# Altium schematic sheet TOP.SchDoc
size A3
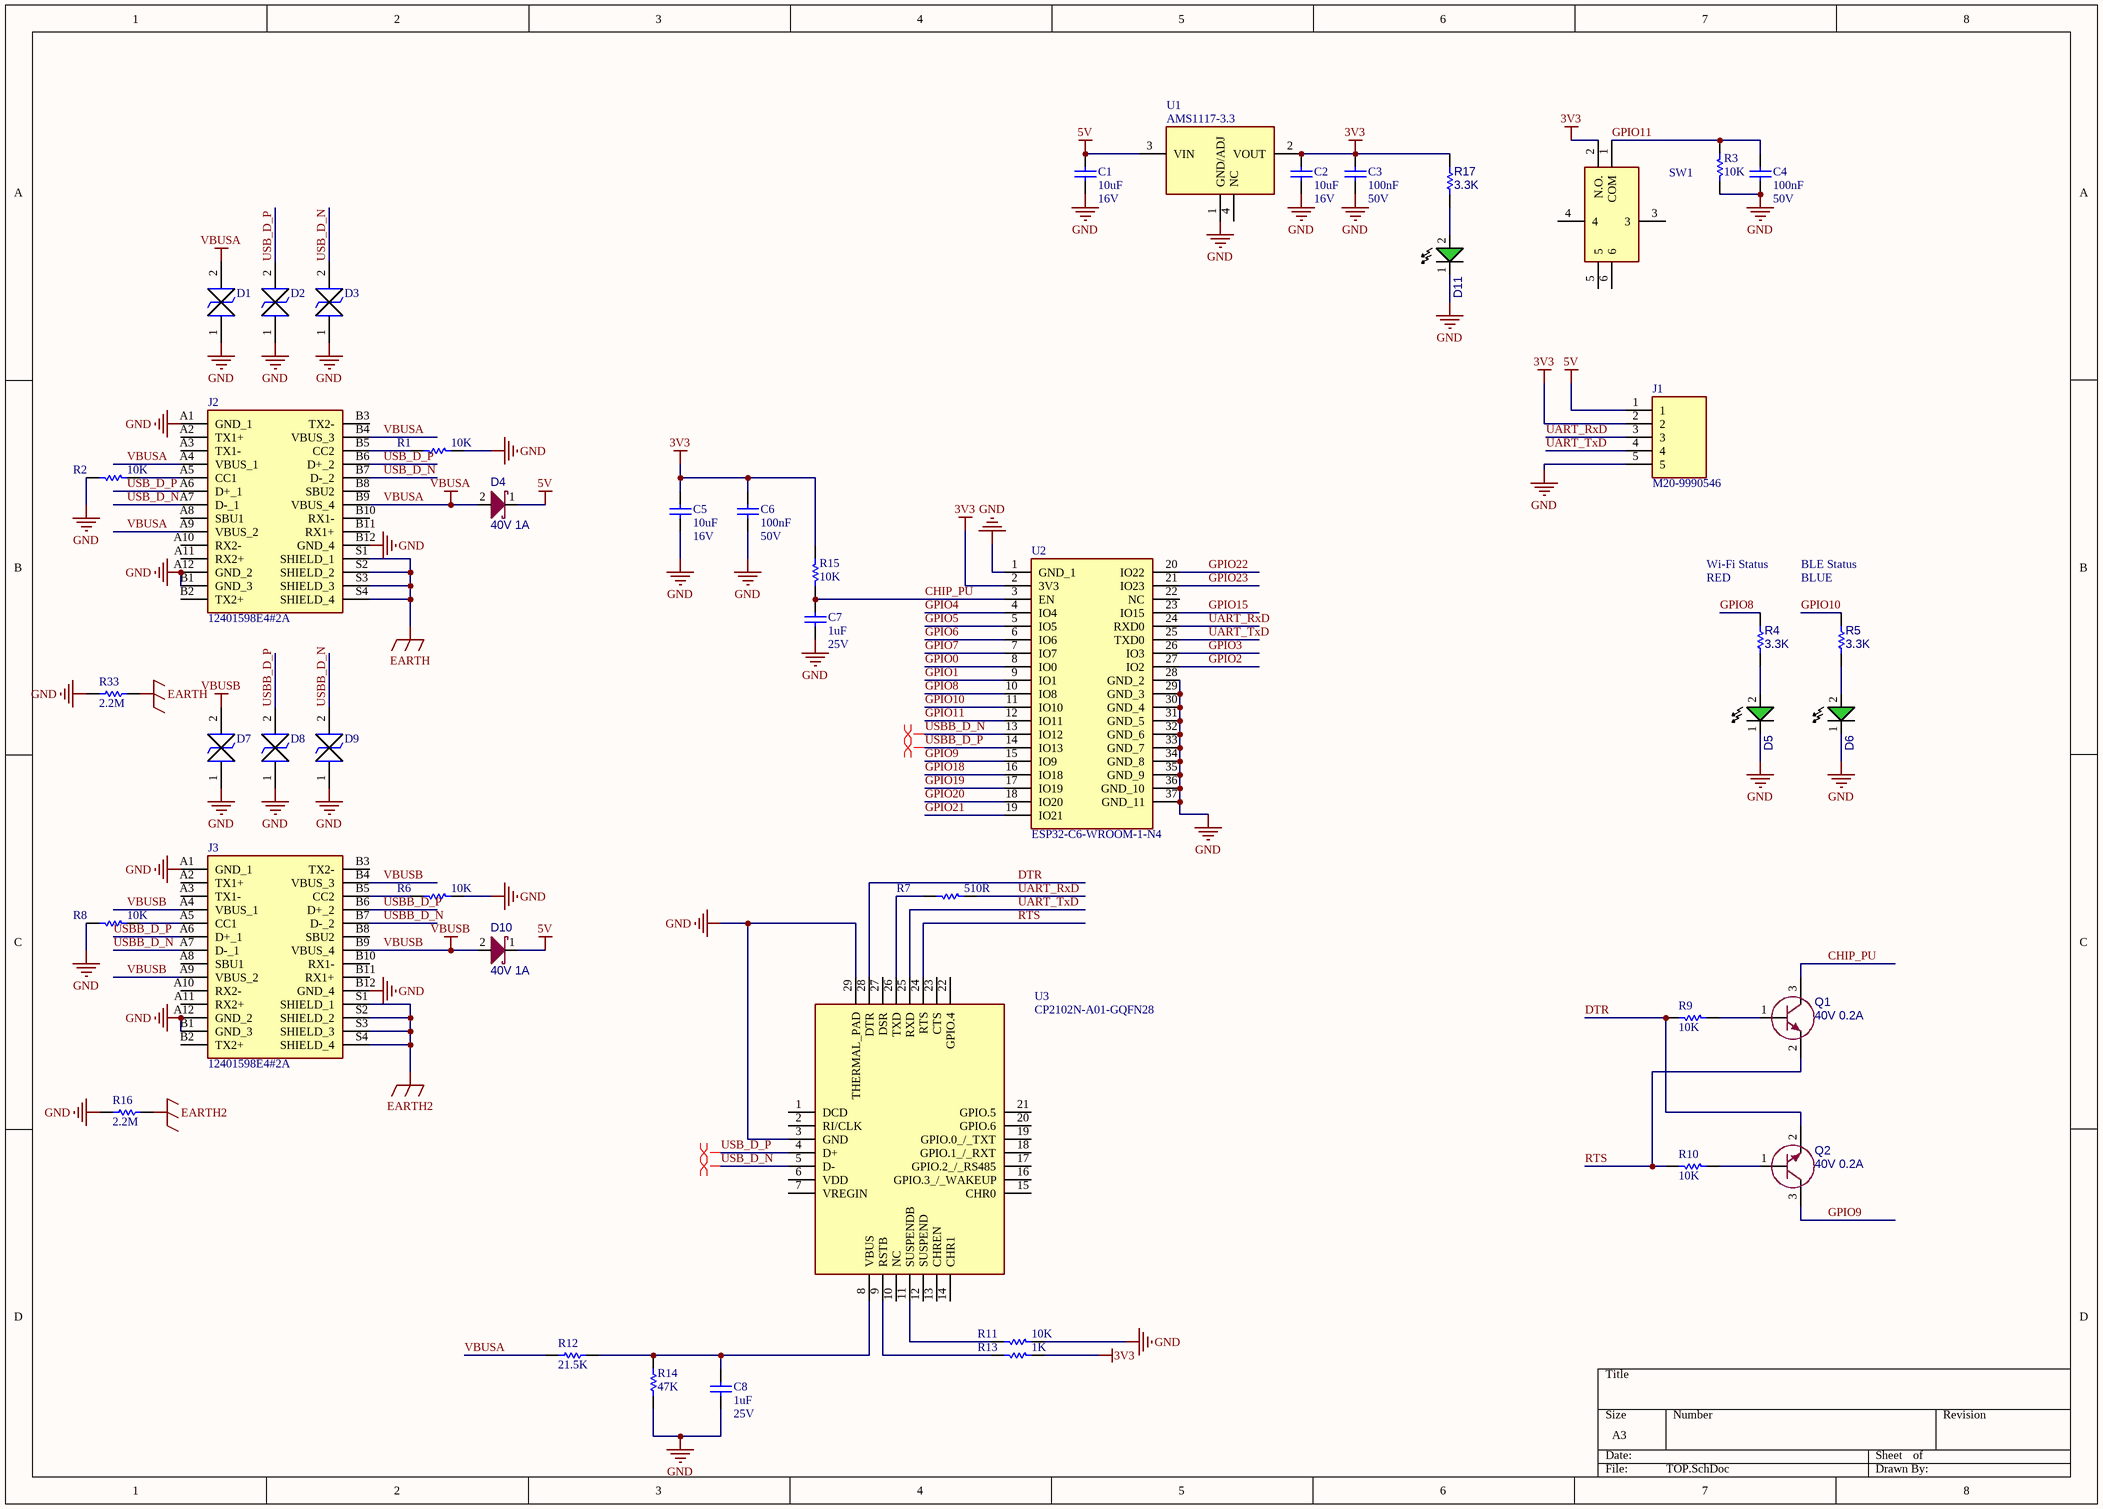
[diagram p0: TOP.SchDoc]

## Parts
C1  value 10uF  Voltage: 16V  [CAP_0805]  (hidden comment: CAP)
C2  value 10uF  Voltage: 16V  [CAP_0805]  (hidden comment: CAP)
C3  value 100nF  Voltage: 50V  [CAP_0603]  (hidden comment: CAP)
C4  value 100nF  Voltage: 50V  [CAP_0603]  (hidden comment: CAP)
C5  value 10uF  Voltage: 16V  [CAP_0805]  (hidden comment: CAP)
C6  value 100nF  Voltage: 50V  [CAP_0603]  (hidden comment: CAP)
C7  value 1uF  Voltage: 25V  [CAP_0603]  (hidden comment: CL10A105KA8NNNC)
C8  value 1uF  Voltage: 25V  [CAP_0603]  (hidden comment: CL10A105KA8NNNC)
D1  ATV02W5V0B-HF  [SODFL3718X130N]  (value not drawn)
D2  ATV02W5V0B-HF  [SODFL3718X130N]  (value not drawn)
D3  ATV02W5V0B-HF  [SODFL3718X130N]  (value not drawn)
D4  value 40V 1A  [SOD-123]  (hidden comment: PMEG4010EGWJ)
D5  PSC-1608U52GC-G4  [LED_0603_GRN]  (value not drawn)
D6  PSC-1608U52GC-G4  [LED_0603_GRN]  (value not drawn)
D7  ATV02W5V0B-HF  [SODFL3718X130N]  (value not drawn)
D8  ATV02W5V0B-HF  [SODFL3718X130N]  (value not drawn)
D9  ATV02W5V0B-HF  [SODFL3718X130N]  (value not drawn)
D10  value 40V 1A  [SOD-123]  (hidden comment: PMEG4010EGWJ)
D11  PSC-1608U52GC-G4  [LED_0603_GRN]  (value not drawn)
J1  M20-9990546  [HDRV5W64P0X254_1X5_1270X254X864P]
J2  12401598E4#2A  [12401598E42A]
J3  12401598E4#2A  [12401598E42A]
Q1  value 40V 0.2A  [SOT23]  (hidden comment: MMBT3904-7-F)
Q2  value 40V 0.2A  [SOT23]  (hidden comment: MMBT3904-7-F)
R1  value 10K  [RES_0603]  (hidden comment: RES)
R2  value 10K  [RES_0603]  (hidden comment: RES)
R3  value 10K  [RES_0603]  (hidden comment: RES)
R4  value 3.3K  [RES_0603]  (hidden comment: 0603SAF3301T5E)
R5  value 3.3K  [RES_0603]  (hidden comment: 0603SAF3301T5E)
R6  value 10K  [RES_0603]  (hidden comment: RES)
R7  value 510R  [R0603]  (hidden comment: 0603SAJ0511T5E)
R8  value 10K  [RES_0603]  (hidden comment: RES)
R9  value 10K  [RES_0603]  (hidden comment: RES)
R10  value 10K  [RES_0603]  (hidden comment: RES)
R11  value 10K  [RES_0603]  (hidden comment: RES)
R12  value 21.5K  [RES_0603]  (hidden comment: 0603SAF2152T5E)
R13  value 1K  [RES_0603]  (hidden comment: RES)
R14  value 47K  [RES_0603]  (hidden comment: RES)
R15  value 10K  [RES_0603]  (hidden comment: RES)
R16  value 2.2M  [RES_0805]  (hidden comment: RES)
R17  value 3.3K  [RES_0603]  (hidden comment: 0603SAF3301T5E)
R33  value 2.2M  [RES_0805]  (hidden comment: RES)
SW1  TS32-7-35-BK-B-260-RA-SMT-TR  [TS32735BKB160RAHSMTTR]  (value not drawn)
U1  AMS1117-3.3  [SOT229P700X180-4N]
U2  ESP32-C6-WROOM-1-N4  [ESP32C6WROOM1N4]
U3  CP2102N-A01-GQFN28  [QFN50P500X500X80-29N-D]

## Nets
3V3: C2.1 C3.1 C5.1 C6.1 J1.2 R13.2 R15.2 R17.2 SW1.2(N.O.) U1.2(VOUT) U2.2(3V3)
5V: C1.1 D4.1 D10.1 J1.1 U1.3(VIN)
EARTH: J2.S1(SHIELD_1) J2.S2(SHIELD_2) J2.S3(SHIELD_3) J2.S4(SHIELD_4) R33.2
EARTH2: J3.S1(SHIELD_1) J3.S2(SHIELD_2) J3.S3(SHIELD_3) J3.S4(SHIELD_4) R16.2
GND: C1.2 C2.2 C3.2 C4.2 C5.2 C6.2 C7.2 C8.2 D1.1 D2.1 D3.1 D5.1 D6.1 D7.1 D8.1 D9.1 D11.1 J1.5 J2.A1(GND_1) J2.A12(GND_2) J2.B1(GND_3) J2.B12(GND_4) J3.A1(GND_1) J3.A12(GND_2) J3.B1(GND_3) J3.B12(GND_4) R1.2 R2.1 R3.1 R6.2 R8.1 R11.2 R14.2 R16.1 R33.1 U1.1(GND/ADJ) U2.1(GND_1) U2.28(GND_2) U2.29(GND_3) U2.30(GND_4) U2.31(GND_5) U2.32(GND_6) U2.33(GND_7) U2.34(GND_8) U2.35(GND_9) U2.36(GND_10) U2.37(GND_11) U3.3(GND) U3.29(THERMAL_PAD)
VBUSA: D1.2 D4.2 J2.A4(VBUS_1) J2.A9(VBUS_2) J2.B4(VBUS_3) J2.B9(VBUS_4) R12.1
VBUSB: D7.2 D10.2 J3.A4(VBUS_1) J3.A9(VBUS_2) J3.B4(VBUS_3) J3.B9(VBUS_4)
CHIP_PU: C7.1 Q1.3(C) R15.1 U2.3(EN)
DTR: Q2.2(E) R9.1 U3.28(DTR)
GPIO0: U2.8(IO0)
GPIO1: U2.9(IO1)
GPIO2: U2.27(IO2)
GPIO3: U2.26(IO3)
GPIO4: U2.4(IO4)
GPIO5: U2.5(IO5)
GPIO6: U2.6(IO6)
GPIO7: U2.7(IO7)
GPIO8: R4.2 U2.10(IO8)
GPIO9: Q2.3(C) U2.15(IO9)
GPIO10: R5.2 U2.11(IO10)
GPIO11: C4.1 R3.2 SW1.1(COM) U2.12(IO11)
GPIO15: U2.23(IO15)
GPIO18: U2.16(IO18)
GPIO19: U2.17(IO19)
GPIO20: U2.18(IO20)
GPIO21: U2.19(IO21)
GPIO22: U2.20(IO22)
GPIO23: U2.21(IO23)
RTS: Q1.2(E) R10.1 U3.24(RTS)
UART_RxD: J1.3 R7.2 U2.24(RXD0)
UART_TxD: J1.4 U2.25(TXD0) U3.25(RXD)
USB_D_N: D3.2 J2.A7(D-_1) J2.B7(D-_2) U3.5(D-)
USB_D_P: D2.2 J2.A6(D+_1) J2.B6(D+_2) U3.4(D+)
USBB_D_N: D9.2 J3.A7(D-_1) J3.B7(D-_2) U2.13(IO12)
USBB_D_P: D8.2 J3.A6(D+_1) J3.B6(D+_2) U2.14(IO13)
NetC8_1: C8.1 R12.2 R14.1 U3.8(VBUS)
NetD5_2: D5.2 R4.1
NetD6_2: D6.2 R5.1
NetD11_2: D11.2 R17.1
NetJ2_A5: J2.A5(CC1) R2.2
NetJ2_B5: J2.B5(CC2) R1.1
NetJ3_A5: J3.A5(CC1) R8.2
NetJ3_B5: J3.B5(CC2) R6.1
NetQ1_1: Q1.1(B) R9.2
NetQ2_1: Q2.1(B) R10.2
NetR7_1: R7.1 U3.26(TXD)
NetR11_1: R11.1 U3.11(SUSPENDB)
NetR13_1: R13.1 U3.9(RSTB)

Not connected (* = marked no-connect by the designer): J2 A2(TX1+) A3(TX1-) A8(SBU1) A10(RX2-) A11(RX2+) B2(TX2+) B3(TX2-) B8(SBU2) B10(RX1-) B11(RX1+); J3 A2(TX1+) A3(TX1-) A8(SBU1) A10(RX2-) A11(RX2+) B2(TX2+) B3(TX2-) B8(SBU2) B10(RX1-) B11(RX1+); SW1 3 4 5 6; U1 4(NC); U2 22(NC); U3 1(DCD) 2(RI/CLK) 6(VDD) 7(VREGIN) 10(NC) 12(SUSPEND) 13(CHREN) 14(CHR1) 15(CHR0) 16(GPIO.3_/_WAKEUP) 17(GPIO.2_/_RS485) 18(GPIO.1_/_RXT) 19(GPIO.0_/_TXT) 20(GPIO.6) 21(GPIO.5) 22(GPIO.4) 23(CTS) 27(DSR)

## Layout directives
differential pair; differential pair class USBA: USB_D_N, USB_D_P
differential pair; differential pair class USBB; rule Impedance Constraint [Min = 98.00    Max = 102.0    ]: USBB_D_N, USBB_D_P

## Notes on the sheet
- Wi-Fi Status
- RED
- BLE Status
- BLUE

## Library data of the parts
C1 C2 C5 = C01758: CAP CER 10UF 16VDC %10 X5R SMD; Manufacturer: Samsung; Manufacturer Part Number: CL21A106KOQNNNE
C3 C4 C6 = C01763: CAP CER 100nF 50VDC %10 X7R SMD; Manufacturer: Samsung; Manufacturer Part Number: CL10B104KB8NNNL
C7 C8 = C01757: CAP CER 1UF 25VDC %10 X5R SMD; Manufacturer: Samsung; Manufacturer Part Number: CL10A105KA8NNNC
D1-D3 D7-D9 = ATV02W5V0B-HF: TVS Diode (Bi-directional); Manufacturer: Comchip Technology; Manufacturer Part Number: ATV02W5V0B-HF
D4 D10 = PMEG4010EGWJ: DIODE SCHOTTKY 40V 1A SOD123; Manufacturer: Nexperia USA Inc.; Manufacturer Part Number: PMEG4010EGWJ
D5 D6 D11 = LTST-C190TGKT: LED GREEN WATER CLEAR 0603 SMD; Manufacturer: HONGLITRONIC; Manufacturer Part Number: PSC-1608U52GC-G4; Value: GREEN
J1 = M20-9990546: Connector; Manufacturer: Harwin; Manufacturer Part Number: M20-9990546
J2 J3 = 12401598E4#2A: Connector; Manufacturer: Amphenol; Manufacturer Part Number: 12401598E4#2A
Q1 Q2 = MMBT3904-7-F: TRANSISTOR NPN 40V 0.2A SOT23-3; Manufacturer: Diodes Incorporated; Manufacturer Part Number: MMBT3904-7-F
R1-R3 R6 R8-R11 R15 = R02995: RES 0603 10k Ohms %1 1/10W 100PPM; Manufacturer: ROYALOHM; Manufacturer Part Number: 0603SAF1002T5E
R4 R5 R17 = 0603SAF3301T5E: RES.(1608) 0603 3.3K Ohms 1% 1/10W 100PPM SMT; Manufacturer: YAGEO; Manufacturer Part Number: RC0603FR-073K74L
R7 = R03005: RES.(1608) 0603 510 Ohms 5% 1/10W-S 100PPM; Manufacturer: ROYALOHM; Manufacturer Part Number: 0603SAJ0511T5E
R12 = R03011: RES.(1608) 0603 21.5K Ohms 1% 1/10W-S 100PPM; Manufacturer: ROYALOHM; Manufacturer Part Number: 0603SAF2152T5E
R13 = R02998: RES 0603 1K Ohms 1% 1/10W-S 100PPM; Manufacturer: ROYALOHM; Manufacturer Part Number: 0603SAF1001T5E
R14 = R03000: RES 0603 47K Ohms 1% 1/10W-S 100PPM; Manufacturer: ROYALOHM; Manufacturer Part Number: 0603SAF4702T5E
R16 R33 = R01913: RES SMD 2.2M OHM 1% 1/8W 0805; Manufacturer: Yageo; Manufacturer Part Number: RC0805FR-072M2L
SW1 = TS32-7-35-BK-B-260-RA-SMT-TR: Switch; Manufacturer: Same Sky; Manufacturer Part Number: TS32-7-35-BK-B-260-RA-SMT-TR
U1 = AMS1117-3.3: Integrated Circuit; Manufacturer: Advanced; Manufacturer Part Number: AMS1117-3.3
U2 = ESP32-C6-WROOM-1-N4: Integrated Circuit; Manufacturer: Espressif Systems; Manufacturer Part Number: ESP32-C6-WROOM-1-N4
U3 = CP2102N-A01-GQFN28: Integrated Circuit; Manufacturer: Silicon Labs; Manufacturer Part Number: CP2102N-A01-GQFN28